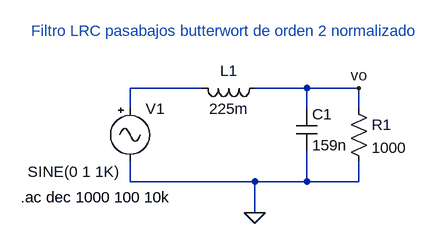
[diagram p0: schematic tp_2_1_desnormalizado.asc]
tp_2_1_desnormalizado.asc, the LTspice schematic file:
Version 4
SHEET 1 880 680
WIRE 448 224 336 224
WIRE 608 224 528 224
WIRE 688 224 608 224
WIRE 336 256 336 224
WIRE 608 256 608 224
WIRE 688 256 688 224
WIRE 336 368 336 336
WIRE 528 368 336 368
WIRE 608 368 608 320
WIRE 608 368 528 368
WIRE 688 368 688 336
WIRE 688 368 608 368
WIRE 528 416 528 368
FLAG 528 416 0
FLAG 688 224 vo
SYMBOL res 672 240 R0
SYMATTR InstName R1
SYMATTR Value 1000
SYMBOL cap 592 256 R0
SYMATTR InstName C1
SYMATTR Value 159n
SYMBOL ind 544 208 R90
WINDOW 0 5 56 VBottom 2
WINDOW 3 32 56 VTop 2
SYMATTR InstName L1
SYMATTR Value 225m
SYMBOL Misc/signal 336 240 R0
WINDOW 3 -157 113 Left 2
SYMATTR InstName V1
SYMATTR Value2 AC 1
TEXT 168 392 Left 2 !.ac dec 1000 100 10k
TEXT 184 136 Left 2 ;Filtro LRC pasabajos butterwort de orden 2 normalizado

The netlist it stands for:
* tp_2_1_desnormalizado.asc
R1 vo 0 1000
C1 vo 0 159n
L1 vo N001 225m
V1 N001 0 SINE(0 1 1K) AC 1
.ac dec 1000 100 10k
* Filtro LRC pasabajos butterwort de orden 2 normalizado
.backanno
.end